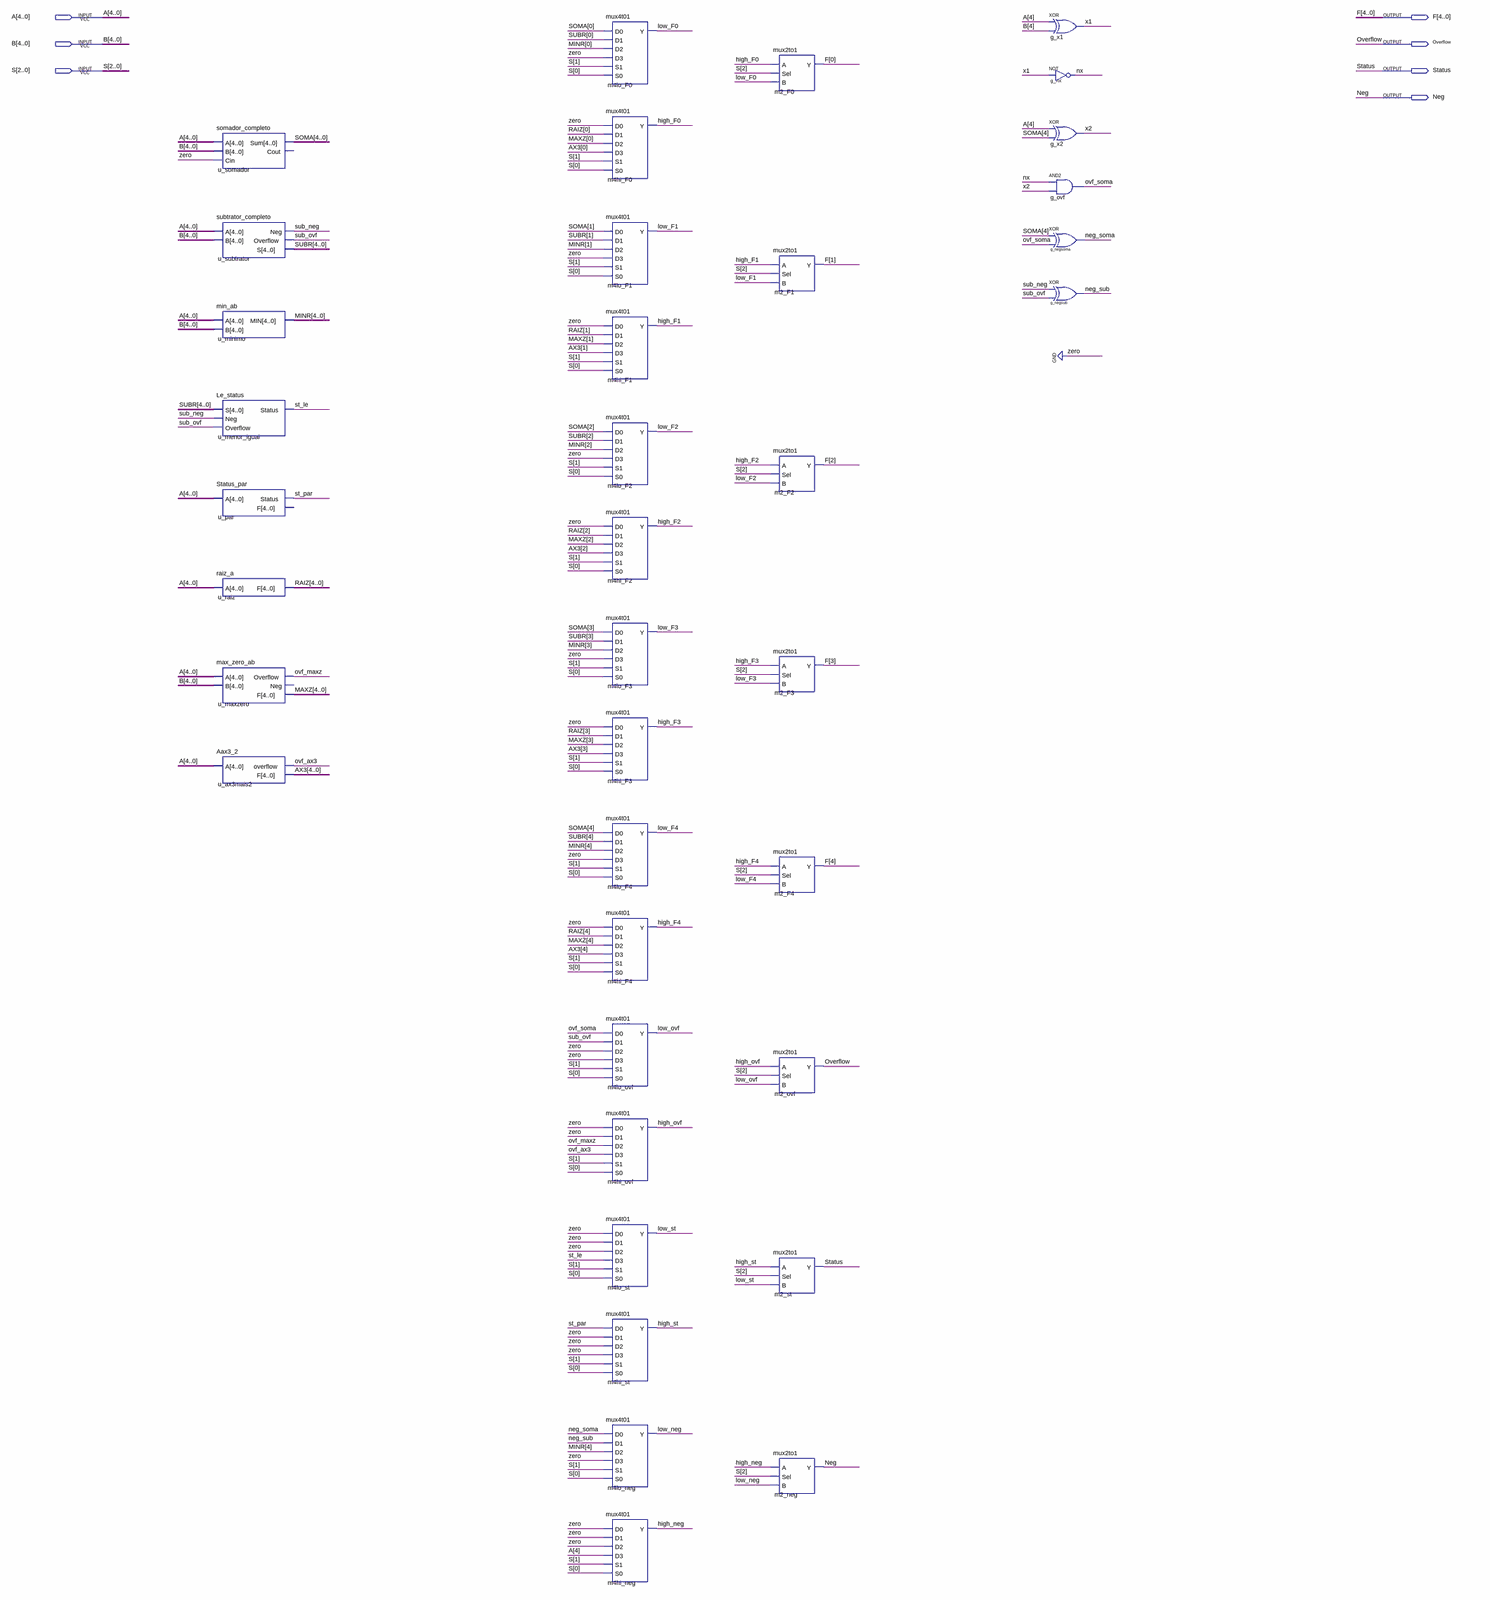
[diagram p0: schematic sheet, whole]
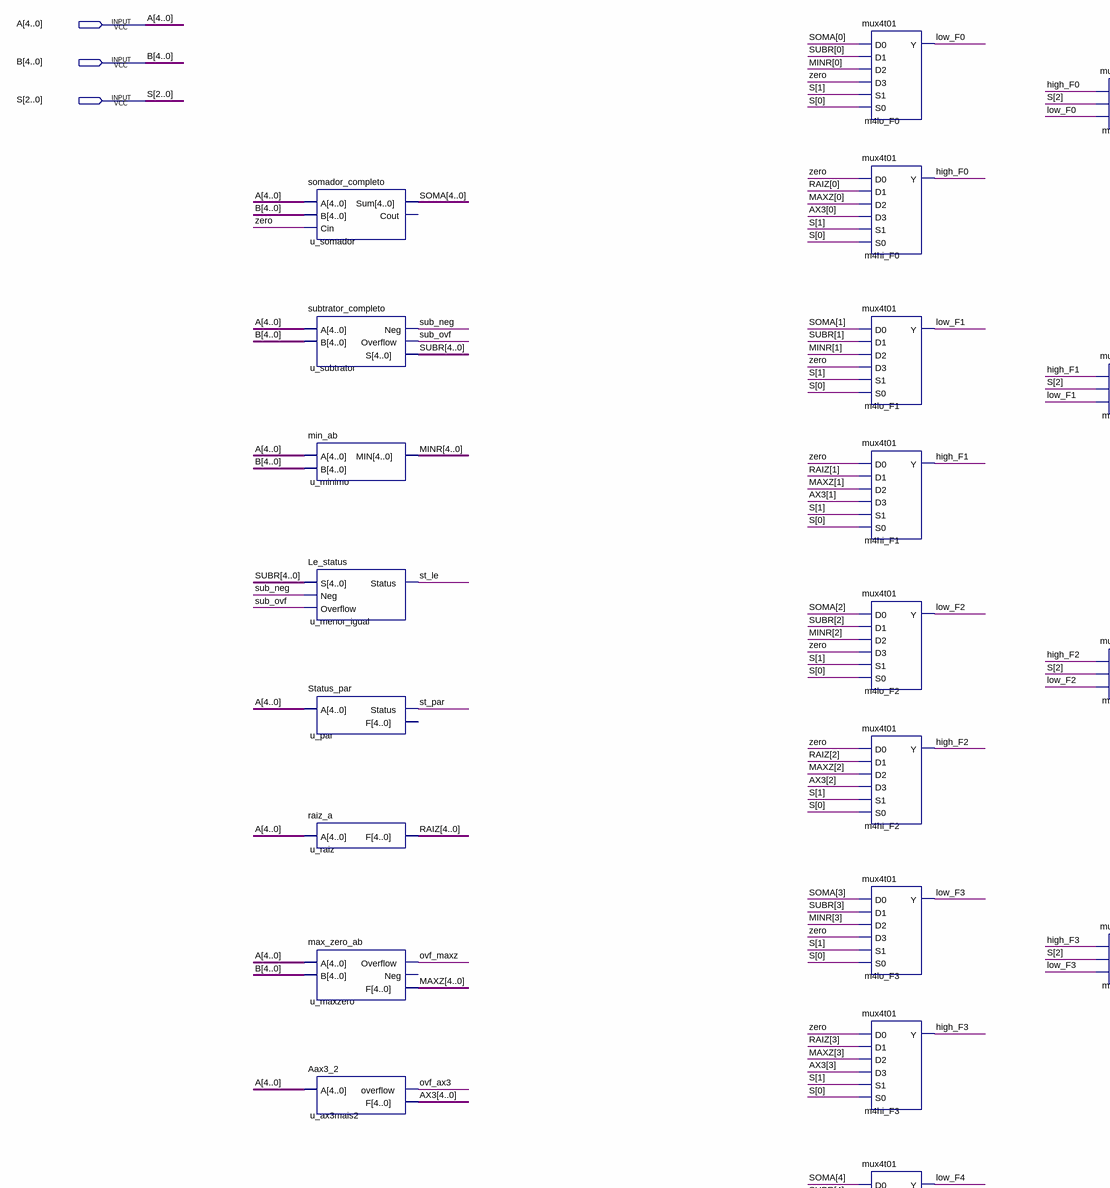
[diagram p1: schematic sheet, upper left part]
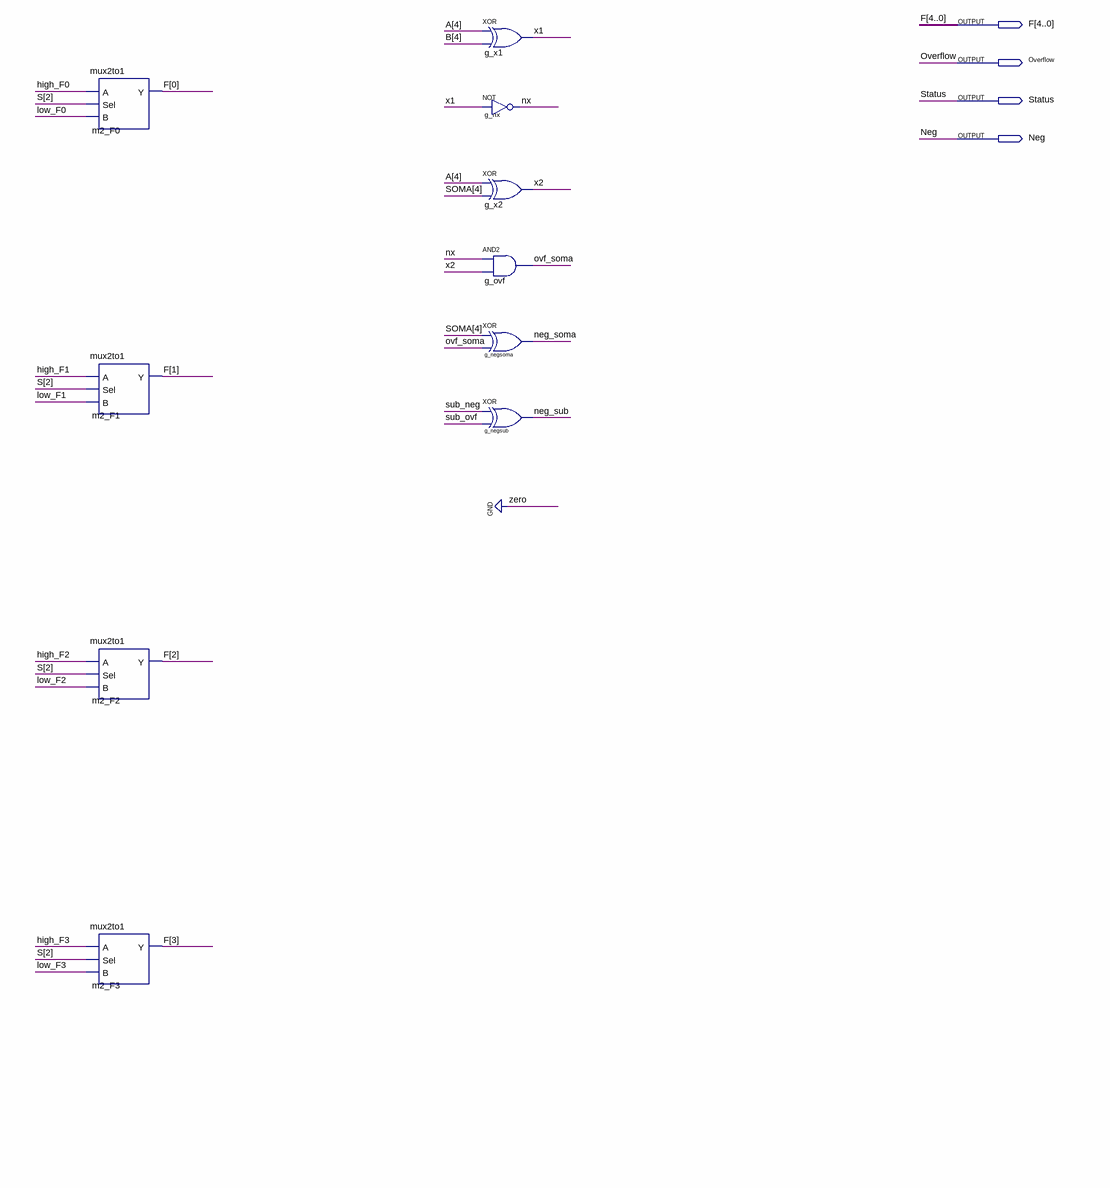
[diagram p2: schematic sheet, upper right part]
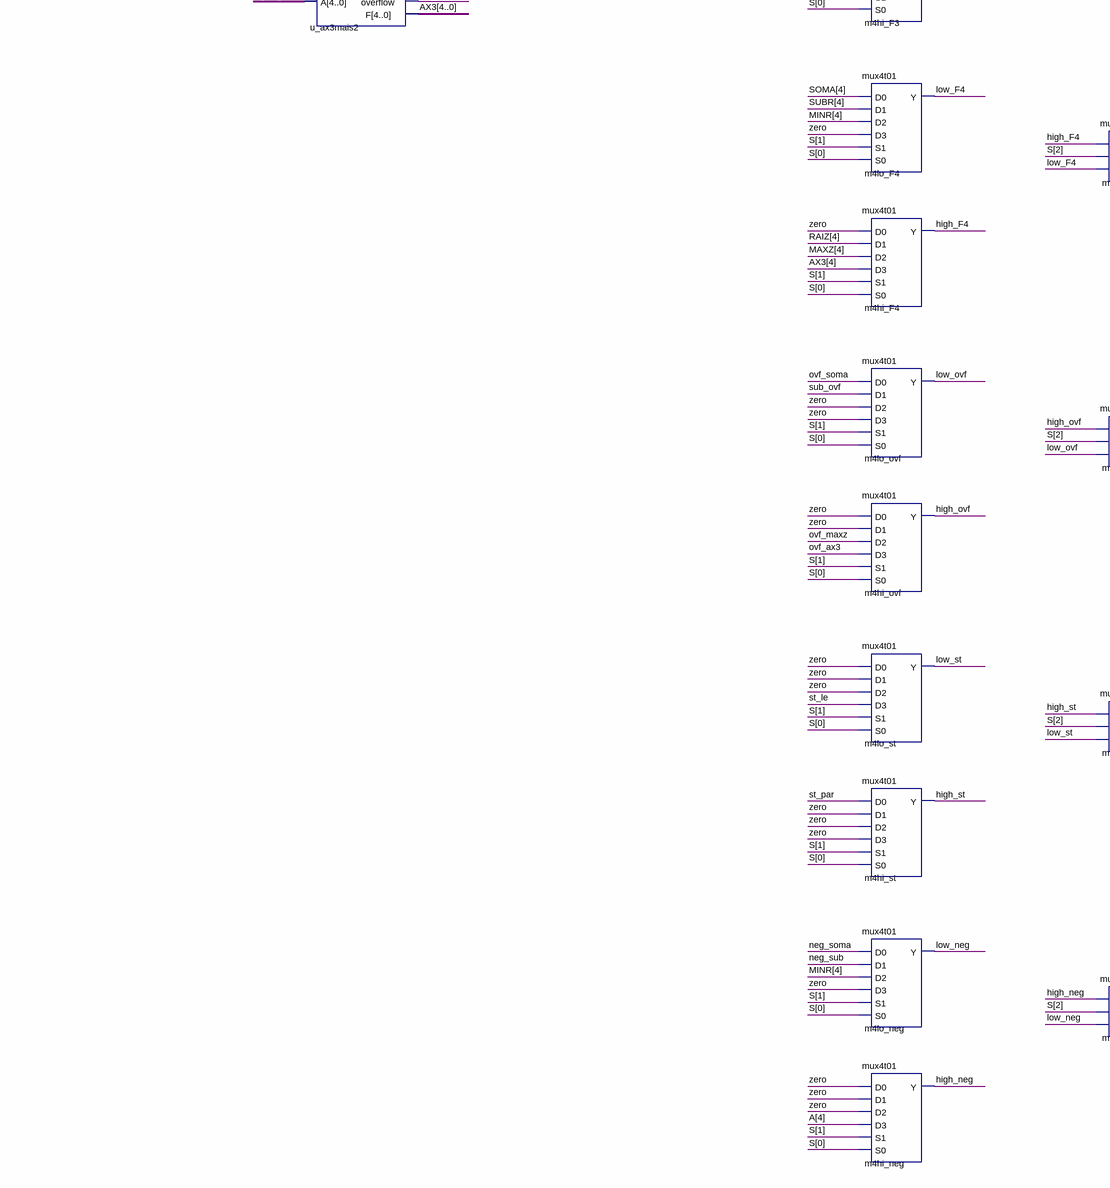
[diagram p3: schematic sheet, lower left part]
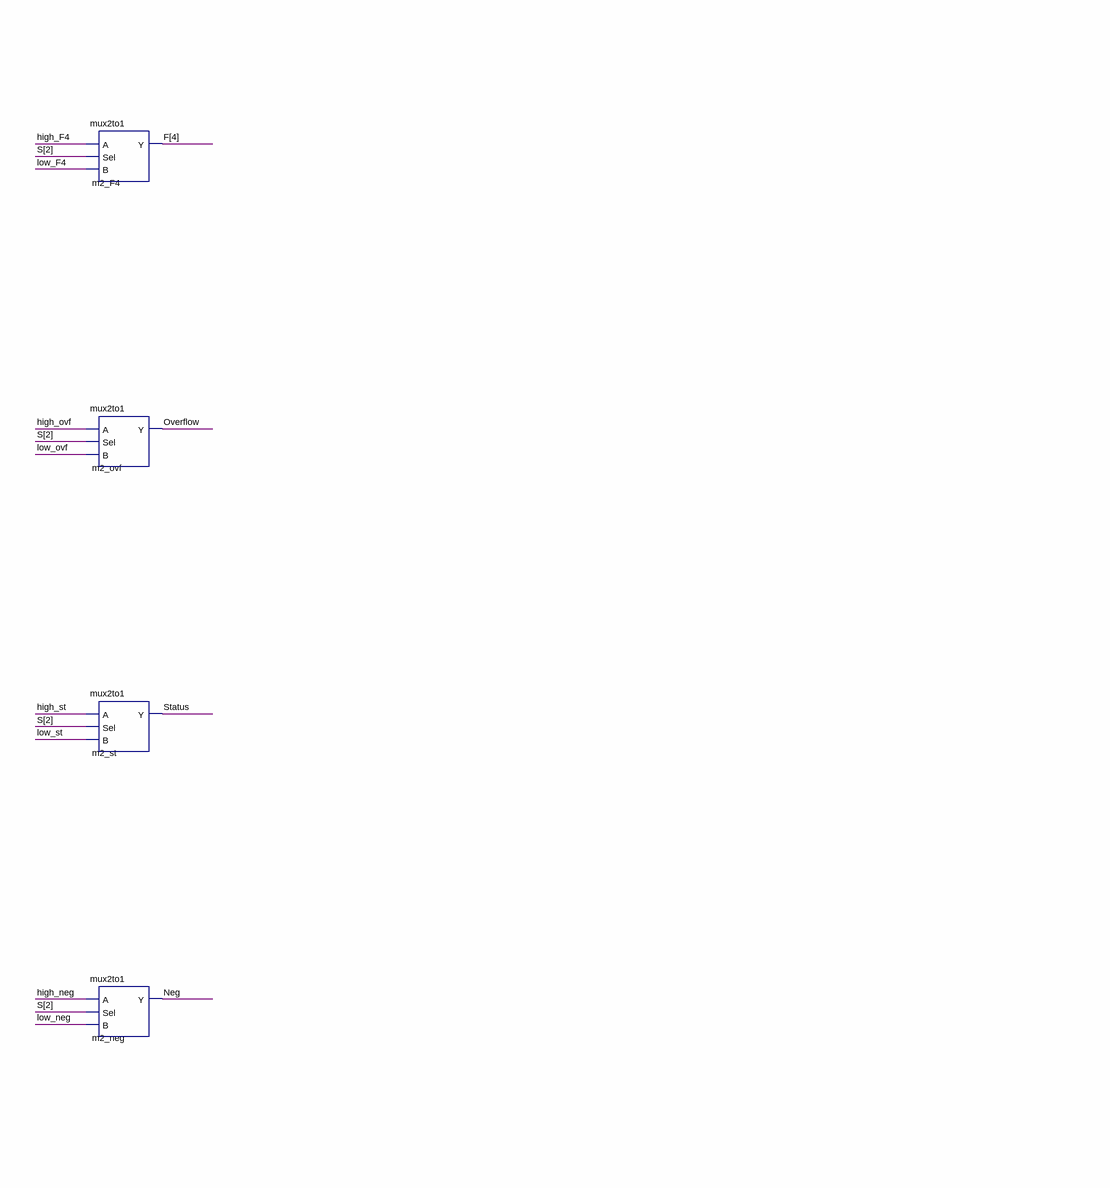
[diagram p4: schematic sheet, lower right part]
// Quartus schematic ulaa.bdf as structural Verilog: 38 symbols, 7 pins
module ulaa (
  input  [4:0] A,
  input  [4:0] B,
  input  [2:0] S,
  output [4:0] F,
  output Overflow,
  output Status,
  output Neg
);

  wire high_F0, high_F1, high_F2, high_F3, high_F4, high_neg, high_ovf, high_st, low_F0, low_F1, low_F2,
       low_F3, low_F4, low_neg, low_ovf, low_st, neg_soma, neg_sub, nx, ovf_ax3, ovf_maxz, ovf_soma, st_le,
       st_par, sub_neg, sub_ovf, x1, x2;
  wire [4:0] AX3, MAXZ, MINR, RAIZ, SOMA, SUBR;

  somador_completo u_somador (.A(A), .B(B), .Cin(1'b0), .Sum(SOMA));  // open: Cout
  subtrator_completo u_subtrator (.A(A), .B(B), .Neg(sub_neg), .Overflow(sub_ovf), .S(SUBR));
  min_ab u_minimo (.A(A), .B(B), .MIN(MINR));
  Le_status u_menor_igual (.S(SUBR), .Neg(sub_neg), .Overflow(sub_ovf), .Status(st_le));
  Status_par u_par (.A(A), .Status(st_par));  // open: F
  raiz_a u_raiz (.A(A), .F(RAIZ));
  max_zero_ab u_maxzero (.A(A), .B(B), .Overflow(ovf_maxz), .F(MAXZ));  // open: Neg
  Aax3_2 u_ax3mais2 (.A(A), .overflow(ovf_ax3), .F(AX3));
  mux4t01 m4lo_F0 (.D0(SOMA[0]), .D1(SUBR[0]), .D2(MINR[0]), .D3(1'b0), .S1(S[1]), .S0(S[0]), .Y(low_F0));
  mux4t01 m4hi_F0 (.D0(1'b0), .D1(RAIZ[0]), .D2(MAXZ[0]), .D3(AX3[0]), .S1(S[1]), .S0(S[0]), .Y(high_F0));
  mux4t01 m4lo_F1 (.D0(SOMA[1]), .D1(SUBR[1]), .D2(MINR[1]), .D3(1'b0), .S1(S[1]), .S0(S[0]), .Y(low_F1));
  mux4t01 m4hi_F1 (.D0(1'b0), .D1(RAIZ[1]), .D2(MAXZ[1]), .D3(AX3[1]), .S1(S[1]), .S0(S[0]), .Y(high_F1));
  mux4t01 m4lo_F2 (.D0(SOMA[2]), .D1(SUBR[2]), .D2(MINR[2]), .D3(1'b0), .S1(S[1]), .S0(S[0]), .Y(low_F2));
  mux4t01 m4hi_F2 (.D0(1'b0), .D1(RAIZ[2]), .D2(MAXZ[2]), .D3(AX3[2]), .S1(S[1]), .S0(S[0]), .Y(high_F2));
  mux4t01 m4lo_F3 (.D0(SOMA[3]), .D1(SUBR[3]), .D2(MINR[3]), .D3(1'b0), .S1(S[1]), .S0(S[0]), .Y(low_F3));
  mux4t01 m4hi_F3 (.D0(1'b0), .D1(RAIZ[3]), .D2(MAXZ[3]), .D3(AX3[3]), .S1(S[1]), .S0(S[0]), .Y(high_F3));
  mux4t01 m4lo_F4 (.D0(SOMA[4]), .D1(SUBR[4]), .D2(MINR[4]), .D3(1'b0), .S1(S[1]), .S0(S[0]), .Y(low_F4));
  mux4t01 m4hi_F4 (.D0(1'b0), .D1(RAIZ[4]), .D2(MAXZ[4]), .D3(AX3[4]), .S1(S[1]), .S0(S[0]), .Y(high_F4));
  mux4t01 m4lo_ovf (.D0(ovf_soma), .D1(sub_ovf), .D2(1'b0), .D3(1'b0), .S1(S[1]), .S0(S[0]), .Y(low_ovf));
  mux4t01 m4hi_ovf (.D0(1'b0), .D1(1'b0), .D2(ovf_maxz), .D3(ovf_ax3), .S1(S[1]), .S0(S[0]), .Y(high_ovf));
  mux4t01 m4lo_st (.D0(1'b0), .D1(1'b0), .D2(1'b0), .D3(st_le), .S1(S[1]), .S0(S[0]), .Y(low_st));
  mux4t01 m4hi_st (.D0(st_par), .D1(1'b0), .D2(1'b0), .D3(1'b0), .S1(S[1]), .S0(S[0]), .Y(high_st));
  mux4t01 m4lo_neg (.D0(neg_soma), .D1(neg_sub), .D2(MINR[4]), .D3(1'b0), .S1(S[1]), .S0(S[0]), .Y(low_neg));
  mux4t01 m4hi_neg (.D0(1'b0), .D1(1'b0), .D2(1'b0), .D3(A[4]), .S1(S[1]), .S0(S[0]), .Y(high_neg));
  mux2to1 m2_F0 (.A(high_F0), .Sel(S[2]), .B(low_F0), .Y(F[0]));
  mux2to1 m2_F1 (.A(high_F1), .Sel(S[2]), .B(low_F1), .Y(F[1]));
  mux2to1 m2_F2 (.A(high_F2), .Sel(S[2]), .B(low_F2), .Y(F[2]));
  mux2to1 m2_F3 (.A(high_F3), .Sel(S[2]), .B(low_F3), .Y(F[3]));
  mux2to1 m2_F4 (.A(high_F4), .Sel(S[2]), .B(low_F4), .Y(F[4]));
  mux2to1 m2_ovf (.A(high_ovf), .Sel(S[2]), .B(low_ovf), .Y(Overflow));
  mux2to1 m2_st (.A(high_st), .Sel(S[2]), .B(low_st), .Y(Status));
  mux2to1 m2_neg (.A(high_neg), .Sel(S[2]), .B(low_neg), .Y(Neg));
  xor g_x1 (x1, A[4], B[4]);
  not g_nx (nx, x1);
  xor g_x2 (x2, A[4], SOMA[4]);
  and g_ovf (ovf_soma, nx, x2);
  xor g_negsoma (neg_soma, SOMA[4], ovf_soma);
  xor g_negsub (neg_sub, sub_neg, sub_ovf);
endmodule
